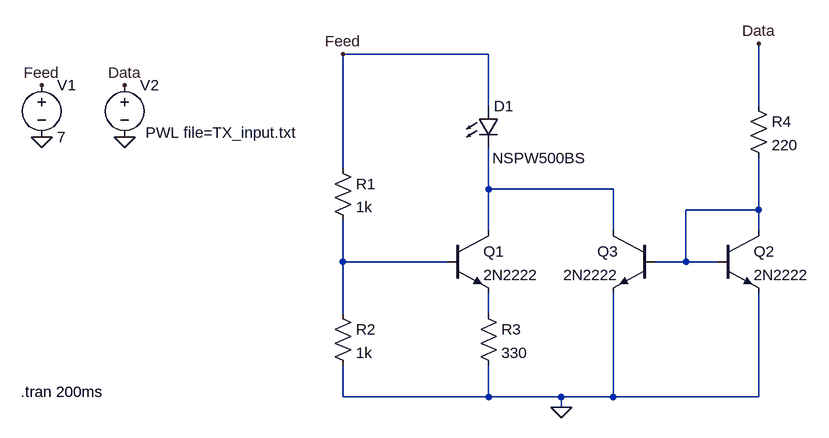
[diagram p0: schematic Transmissor.asc]
Transmissor.asc, the LTspice schematic file:
Version 4
SHEET 1 1096 680
WIRE 592 -176 368 -176
WIRE 592 -96 592 -176
WIRE 1008 -96 1008 -192
WIRE 368 0 368 -176
WIRE 592 32 592 -32
WIRE 784 32 592 32
WIRE 1008 64 1008 -16
WIRE 1008 64 896 64
WIRE 592 96 592 32
WIRE 784 96 784 32
WIRE 1008 96 1008 64
WIRE 368 144 368 80
WIRE 528 144 368 144
WIRE 896 144 896 64
WIRE 896 144 848 144
WIRE 944 144 896 144
WIRE 368 224 368 144
WIRE 592 224 592 192
WIRE 368 352 368 304
WIRE 592 352 592 304
WIRE 592 352 368 352
WIRE 704 352 592 352
WIRE 784 352 784 192
WIRE 784 352 704 352
WIRE 1008 352 1008 192
WIRE 1008 352 784 352
WIRE 704 368 704 352
FLAG 32 -48 0
FLAG -96 -48 0
FLAG 704 368 0
FLAG -96 -128 Feed
FLAG 32 -128 Data
FLAG 1008 -192 Data
FLAG 368 -176 Feed
SYMBOL voltage -96 -144 R0
WINDOW 123 0 0 Left 0
WINDOW 39 0 0 Left 0
SYMATTR InstName V1
SYMATTR Value 7
SYMBOL voltage 32 -144 R0
WINDOW 3 32 89 Left 2
WINDOW 123 32 117 Left 2
WINDOW 39 0 0 Left 0
SYMATTR Value PWL file=TX_input.txt
SYMATTR InstName V2
SYMBOL res 352 208 R0
SYMATTR InstName R2
SYMATTR Value 1k
SYMBOL res 576 208 R0
SYMATTR InstName R3
SYMATTR Value 330
SYMBOL res 352 -16 R0
SYMATTR InstName R1
SYMATTR Value 1k
SYMBOL npn 528 96 R0
SYMATTR InstName Q1
SYMATTR Value 2N2222
SYMBOL npn 848 96 M0
SYMATTR InstName Q3
SYMATTR Value 2N2222
SYMBOL npn 944 96 R0
SYMATTR InstName Q2
SYMATTR Value 2N2222
SYMBOL LED 576 -96 R0
WINDOW 3 22 80 Left 2
SYMATTR Value NSPW500BS
SYMATTR InstName D1
SYMBOL res 992 -112 R0
SYMATTR InstName R4
SYMATTR Value 220
TEXT -128 344 Left 2 !.tran 200ms

The netlist it stands for:
* Transmissor.asc
V1 Feed 0 7
V2 Data 0 PWL file=TX_input.txt
R2 N003 0 1k
R3 N004 0 330
R1 Feed N003 1k
Q1 N001 N003 N004 0 2N2222
Q3 N001 N002 0 0 2N2222
Q2 N002 N002 0 0 2N2222
D1 Feed N001 NSPW500BS
R4 Data N002 220
.model D D
.lib standard.dio
.model NPN NPN
.model PNP PNP
.lib standard.bjt
.tran 200ms
.backanno
.end